# Altium schematic sheet High_Voltage_Converter.SchDoc
size A4
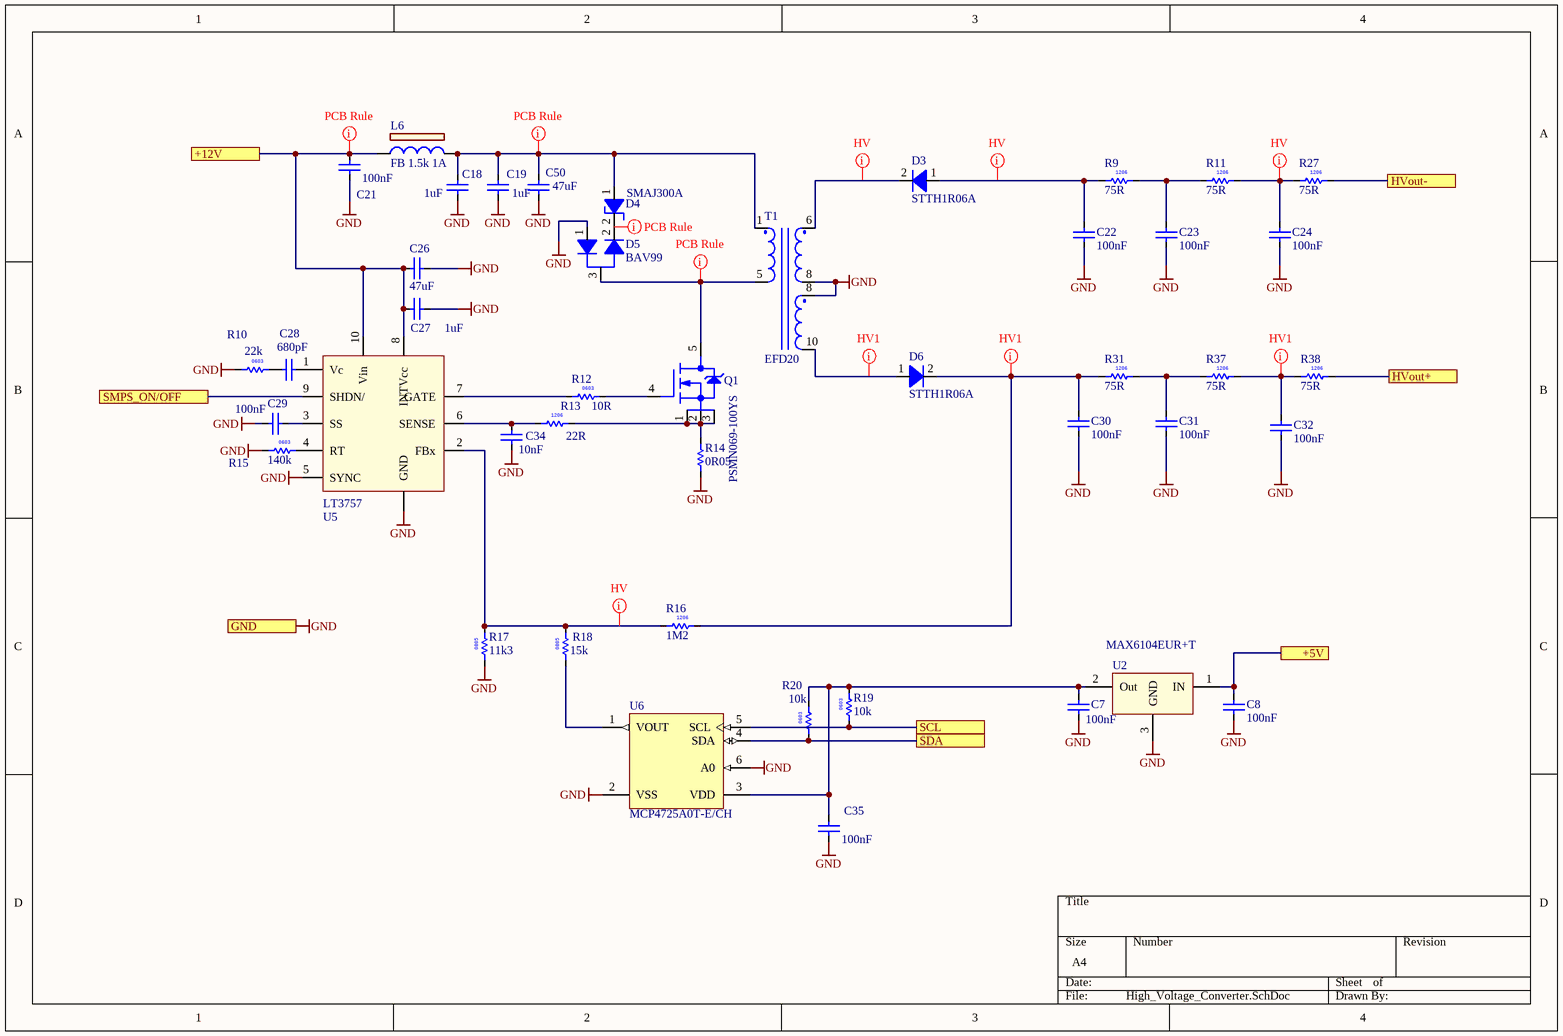
[diagram p0: High_Voltage_Converter.SchDoc]

## Parts
C7  100nF  [C0603V]
C8  100nF  [C0603V]
C18  1uF  [CAPC2012N]
C19  1uF  [CAPC2012N]
C21  100nF  [C0603V]
C22  100nF  [C1808]
C23  100nF  [C1808]
C24  100nF  [C1808]
C26  47uF  [CAPC3225N]
C27  1uF  [CAPC2012N]
C28  680pF  [CAPC3216N]
C29  100nF  [C0603V]
C30  100nF  [C1808]
C31  100nF  [C1808]
C32  100nF  [C1808]
C34  10nF  [CAPC3216N]
C35  100nF  [C0603V]
C50  47uF  [CAPC3225N]
D3  STTH1R06A  [DO-214AC]
D4  SMAJ300A  [DO-214AC]
D5  BAV99  [SOT95P240-3L]
D6  STTH1R06A  [DO-214AC]
L6  FB 1.5k 1A  [LL0805\2P]
Q1  PSMN069-100YS  [SOT669]
R9  75R  [RESC3216N]
R10  22k  [RESC1608X50N]
R11  75R  [RESC3216N]
R12  10R  [RESC1608N]
R13  22R  [RESC3216N]
R14  0R05  [RESC6432AN]
R15  140k  [RESC1608X50N]
R16  1M2  [RESC3216N]
R17  11k3  [RESC2012N]
R18  15k  [RESC2012N]
R19  10k  [RESC1608N]
R20  10k  [RESC1608N]
R27  75R  [RESC3216N]
R31  75R  [RESC3216N]
R37  75R  [RESC3216N]
R38  75R  [RESC3216N]
T1  EFD20  [EFD_20]
U2  MAX6104EUR+T  [SOT23-3]
U5  LT3757  [10-LEAD PLASTIC MSOP - duplicate]
U6  MCP4725A0T-E/CH  [SOT-23-CH6_N]

## Ports
+5V, +12V, GND, HVout+, HVout-, SCL, SDA, SMPS_ON/OFF

## Nets
GND: C7.1 C8.1 C18.2 C19.2 C21.1 C22.1 C23.1 C24.1 C26.2 C27.2 C29.2 C30.1 C31.1 C32.1 C34.1 C35.1 C50.1 D5.1(A1) R10.1 R14.1 R15.1 R17.1 T1.8 U2.3(GND) U5.5(SYNC) U5.GND U6.2(VSS) U6.6(A0) ; port GND
+5V: C8.2 U2.1(IN) ; port +5V
+12V: C21.2 C26.1 C27.1 L6.1 U5.8(INTVcc) U5.10(Vin) ; port +12V
HVout+: R38.2 ; port HVout+
HVout-: R27.2 ; port HVout-
SCL: R19.1 U6.5(SCL) ; port SCL
SDA: R20.1 U6.4(SDA) ; port SDA
SMPS_ON/OFF: U5.9(SHDN/) ; port SMPS_ON/OFF
NetC7_2: C7.2 C35.2 R19.2 R20.2 U2.2(Out) U6.3(VDD)
NetC18_1: C18.1 C19.1 C50.2 D4.1(ANODE) L6.2 T1.1
NetC22_2: C22.2 D3.1(anode) R9.1
NetC23_2: C23.2 R9.2 R11.1
NetC24_2: C24.2 R11.2 R27.1
NetC28_1: C28.1 R10.2
NetC28_2: C28.2 U5.1(Vc)
NetC29_1: C29.1 U5.3(SS)
NetC30_2: C30.2 D6.2(cathode) R16.2 R31.1
NetC31_2: C31.2 R31.2 R37.1
NetC32_2: C32.2 R37.2 R38.1
NetC34_2: C34.2 R13.1 U5.6(SENSE)
NetD3_2: D3.2(cathode) T1.6
NetD4_2: D4.2(CATHODE) D5.2(A)
NetD5_3: D5.3(K) Q1.5(D) T1.5
NetD6_1: D6.1(anode) T1.10
NetQ1_1: Q1.1(S) Q1.2(S) Q1.3(S) R13.2 R14.2
NetQ1_4: Q1.4(G) R12.2
NetR12_1: R12.1 U5.7(GATE)
NetR15_2: R15.2 U5.4(RT)
NetR16_1: R16.1 R17.2 R18.2 U5.2(FBx)
NetR18_1: R18.1 U6.1(VOUT)

## Layout directives
net class HV: NetC22_2, NetC24_2, NetD3_2
net class HV1: NetC30_2, NetC32_2, NetD6_1
rule Clearance Constraint [Clearance = 0.5mm]; rule Width Constraint [Pref Width = 2mm    Min Width = 0.5mm    Max Width = 2mm]: +12V, NetC18_1, NetD4_2, NetD5_3
net class HV; rule Clearance Constraint [Clearance = 0.5mm]: NetR16_1

## Notes on the sheet
- (in symbol R0000001) 0603
- (in symbol R0000008) 0603
- (in symbol R0000022) 1206
- (in symbol R0000478) 0603
- (in symbol R0000571) 0603
- (in symbol R2408097) 0805
- (in symbol R2412032) 1206
- (in symbol R2412045) 1206

## Library data of the parts
C7 C8 C21 C29 C35 = C0000005: MLCC, 0.1uF 16V 10% X7R 0603; Manufacturer: KEMET; Manufacturer Part Number: C0603C104K4RACTU; Voltage: 16; Project: AUT-RX03-00; Note: 0,041 €; Part Number: C0000005; Part Type: MLCC; Tolerance: 10%; Material: X7R; Package: 0603 (1608 metric); SMD: Yes; Supplier 1: Farnell; Supplier Part Number 1: 1414610RL; Supplier 2: Mouser; Supplier Part Number 2: 80-C0603C104K4R; ComponentLink1Description: MFG link; ComponentLink1URL: http://www.kemet.com/datasheets&C0603C104K4RACTU; Data: 2011.02.27
C18 C19 C27 = C0000037: MLCC, 0805, X5R, 16V, 1UF; Manufacturer: MULTICOMP; Manufacturer Part Number: MCCA000596; Voltage: 16; Tolerance: ±10%; Project: Zhilinskas_I/II/III; Part Number: C0000037; Part Type: MLCC; Material: X5R; Package: 0805 (2012 metric); SMD: Yes; Supplier 1: Farnell; Supplier Part Number 1: 1759479; Price: 0,033; MOQ: 1; Supplier 2: Mouser; Supplier Part Number 2: 77-VJ0805V105ZXJCBC; ComponentLink1Description: MFG link; ComponentLink1URL: http://www.farnell.com/datasheets/462001.pdf; Data: 2011.05.05
C22-C24 C30-C32 = C0000111: MLCC, X7R, 100NF, 630V, 1808; Manufacturer: KEMET; Manufacturer Part Number: C1808V104KBRACTU; Voltage: 630; Tolerance: ± 10%; Part Number: C0000111; Part Type: MLCC; Material: X7R; Package: C1808; SMD: Yes; Supplier 1: Farnell; Supplier 2: Mouser; Supplier Part Number 2: 2085209; ComponentLink1Description: MFG link
C26 C50 = C0000077: MLCC, 1210, 47uF, 16V; Manufacturer: MURATA; Manufacturer Part Number: GRM32ER61C476ME15L; Voltage: 16; Tolerance: ±20%; Material: X5R; Part Number: C0000077; Part Type: MLCC; Package: 1210 (3225 metric); SMD: Yes; Supplier 1: Farnell; Supplier Part Number 1: 1735538; ComponentLink1Description: MFG link; ComponentLink1URL: http://www.farnell.com/datasheets/415303.pdf; Qty: 0; Data: 2012-01-20
C28 = C0000056: MLCC, 680PF, 630V, C0G/NP0, 1206; Manufacturer: MULTICOMP; Manufacturer Part Number: MC1206N681J631CT; Voltage: 630; Tolerance: ±5%; Part Number: C0000056; Part Type: MLCC; Material: C0G / NP0; Package: 1206 (3216 metric); SMD: Yes; Supplier 1: Farnell; Supplier Part Number 1: 1875399; ComponentLink1Description: MFG link; Qty: 5; Data: 2011.07.27
C34 = C0000012: MLCC, 10nF, 630V, ±10% ,X7R, 1206; Manufacturer: TDK; Manufacturer Part Number: C3216X7R2J103M; Voltage: 630; Project: AUT-RX03-00; Note: 0,182 €; Part Number: C0000012; Part Type: MLCC; Tolerance: ±10%; Material: X7R; Package: 1206 (3216 metric); SMD: Yes; Supplier 2: Mouser; Supplier Part Number 2: 810-C3216X7R2J103M; ComponentLink1Description: MFG link; ComponentLink1URL: http://www.tdk.co.jp/tefe02/e413_c.pdf; Data: 2011.02.28
D3 D6 = D0000024: DIODE, fast, 1A, 600V, SMD, SMA; Manufacturer: ST Microelectronics; Vforvard: 1V; Capacitance: 12pF; Part Number: D0000024; Part Type: Diode\Rectifier; Reverse Voltage: 600V; Current: 1A; SMD: Yes; Manufacturer Part Number: STTH1R06A; ComponentLink1Description: MFG link; ComponentLink1URL: http://www.st.com/internet/com/TECHNICAL_RESOURCES/TECHNICAL_LITERATURE/DATASHEET/CD00005135.pdf; ComponentLink2Description: DataSheet; Qty: 5; Data: 2011.06.30; Supplier 1: Farnell; Supplier Part Number 1: 1697520
D4 = D0000021: TVS DIODE, 400W, 300V, DO-214AC; Manufacturer: LITTELFUSE; Part Number: D0000021; Part Type: Diode\TVS\Unidir; Vforvard: 300V; Rating: 400W; SMD: Yes; Manufacturer Part Number: SMAJ300A; ComponentLink1Description: MFG link; ComponentLink1URL: http://www.littelfuse.com/data/en/Data_Sheets/Littelfuse_TVS-Diode_SMAJ.pdf; ComponentLink2Description: DataSheet; Qty: 5; Data: 2011.07.15; Supplier 1: Farnell; Supplier Part Number 1: 1677461; Supplier 2: Mouser; Supplier Part Number 2: 576-SMAJ300A
D5 = D0000001: DIODE SW DUAL 75V 350mW SOT23; Manufacturer Part Number: BAV99-7-F; Vforvard: 1.25V; Current: 2A; Project: AUT-RX03-00; Note: 0,289 €; Part Number: D0000001; Part Type: Diode\Small signal; Reverse Voltage: 75V; Rating: 350mW; SMD: Yes; ComponentLink1Description: MFG link; ComponentLink1URL: http://www.onsemi.com/pub_link/Collateral/BAV99LT1-D.PDF; ComponentLink2Description: DataSheet; Qty: 6000; Data: 2011.02.27; Supplier 1: Farnell; Supplier Part Number 1: 1843683; Supplier 2: Mouser; Supplier Part Number 2: 621-BAV99-F
L6 = L0000004: BEAD FERRITE, SMD 1500OHM, 0805; Manufacturer: Wurth Elektronik; Manufacturer Part Number: 742792097; Resistance: 1500; Project: PSP500; Part Number: L0000004; Part Type: Ferrite\Bead; SMD: Yes; Supplier 1: Farnell; Supplier Part Number 1: 1635738; Supplier 2: Mouser; Supplier Part Number 2: 710-742792097; ComponentLink1Description: MFG link; ComponentLink1URL: http://katalog.we-online.de/kataloge/eisos/media/pdf/742792097.pdf; ComponentLink2Description: DataSheet; Data: 2011.02.01
Q1 = Q0000050: MOSFET 100V, 72.4 mOhm standard level, LFPAK; Manufacturer: NXP; RdsON: 130mΩ; Id: 17A; InputCapacitance: 645pF; Part Number: Q0000050; Part Type: MOSFET\N-CH; Vds: 100V; SMD: Yes; Manufacturer Part Number: PSMN069-100YS; Supplier 1: Farnell; Supplier Part Number 1: 1845662RL; ComponentLink1Description: MFG link; ComponentLink1URL: http://www.nxp.com/documents/data_sheet/PSMN069-100YS.pdf; ComponentLink2Description: Datasheet MFG; Qty: 10; Data: 2012.03.26
R9 R11 R27 R31 R37 R38 = R2412045: 75R 5% 1206 1/4W; R2408042: R2412045; Part type: Carbon Film; Tolerance: ±5%; Power: 1/4W; Package: 1206 (3216 metric); SMD: Yes; Data: 2011-01-31
R10 = R0000478: Res, 22K, 0603 (1608 metric), ±1%, 100mW, 75V; Manufacturer: PANASONIC; Manufacturer Part Number: ERJ3EKF2202V; R2408042: R0000478; Part type: Thick Film; Tolerance: ±1%; Power: 100mW; Package: 0603 (1608 metric); SMD: Yes; Supplier 1: Farnell; ComponentLink1Description: MFG link; ComponentLink1URL: http://www.farnell.com/datasheets/1678782.pdf; Data: 2015.09.15
R12 = R0000001: Res, 0603 0.1W 5%; Manufacturer: PANASONIC; Manufacturer Part Number: ERJ-3GEYJ100V; R2408042: R0000001; Part type: Thick Film; Tolerance: ±5%; Power: 0.1W; Package: 0603 (1608 metric); SMD: Yes; Supplier 1: Farnell; Supplier Part Number 1: 2059548; Supplier 2: Mouser; Supplier Part Number 2: 667-ERJ-3GEYJ100V; ComponentLink1Description: Datasheet MFG; ComponentLink1URL: http://www.panasonic.com/industrial/components/pdf/AOA0000CE1.pdf; Data: 2011.02.27
R13 = R2412032: 22R 5% 1206 1/4W; R2408042: R2412032; Part type: Carbon Film; Tolerance: ±5%; Power: 1/4W; Package: 1206 (3216 metric); SMD: Yes; Data: 2011.01.31
R14 = R2412183: Res, 0.05R 1% 2512 1W; Manufacturer: WELWYN; Manufacturer Part Number: LR2512-R05FW; Note: S; R2408042: R2412183; Part type: Thick Film; Tolerance: ±1%; Power: 1W; Package: 2512 (6431 metric); SMD: Yes; Supplier 1: Farnell; Supplier Part Number 1: 1100065; ComponentLink1Description: MFG link; Qty: 5; Data: 2011.09.22
R15 = R0000571: Res, 140K, 0603 (1608 metric), ±1%, 100mW, 75V; Manufacturer: PANASONIC; Manufacturer Part Number: ERJ3EKF1403V; R2408042: R0000571; Part type: Thick Film; Tolerance: ±1%; Power: 100mW; Package: 0603 (1608 metric); SMD: Yes; Supplier 1: Farnell; ComponentLink1Description: MFG link; ComponentLink1URL: http://www.farnell.com/datasheets/1678782.pdf; Data: 2015.09.15
R16 = R0000022: Res, 1M 0.25W, 1% 1206; Manufacturer: Bourns; Manufacturer Part Number: CR1206-FX-1004ELF; Project: AUT-RX03-00; Note: 0,041 €; R2408042: R0000022; Part type: Thick Film; Tolerance: ±1%; Power: 0.25W; Package: 1206 (3216 metric); SMD: Yes; Supplier 2: Mouser; Supplier Part Number 2: 652-CR1206FX-1004ELF; ComponentLink1Description: Datasheet MFG; ComponentLink1URL: http://www.bourns.com/data/global/pdfs/CHPREZTR.pdf; Data: 2011.03.05
R17 R18 = R2408097: Res, 11K 5% 0805 1/8W; R2408042: R2408097; Part type: Carbon Film; Tolerance: ±5%; Power: 1/8W; Package: 0805 (2012 metric); SMD: Yes; Data: 2011.01.31
R19 R20 = R0000008: Res, 10K 0.063W 75V 1%  0603; Manufacturer: MULTICOMP; Manufacturer Part Number: MCMR06X1002FTL; Project: AUT-RX03-00; Note: 0,033 €; R2408042: R0000008; Part type: Thick Film; Tolerance: ±1%; Power: 0.063W; Package: 0603 (1608 metric); SMD: Yes; Supplier 1: Farnell; Supplier Part Number 1: 2073349; Supplier 2: Mouser; Supplier Part Number 2: 594-MCT06030C1002FP5; ComponentLink1Description: Datasheet MFG; ComponentLink1URL: http://www.vishay.com/doc?28705; Data: 2011.02.28
T1 = EFD_20: Supplier 1: Newark; Supplier Part Number 1: 06W0667
U2 = MAX6104EUR+T: Low-Cost, Micropower, Low-Dropout,  High-Output-Current, SOT23 Voltage References; Supplier 1: Farnell; Supplier Part Number 1: 2511340
U5 = LT3757: Boost, Flyback, SEPIC and  Inverting Controller; Supplier 1: Farnell; Supplier Part Number 1: 2294952
U6 = MCP4725A0T-E/CH: 12-Bit Digital-to-Analog Converter with EEPROM Memory in SOT-23-6, 6-Pin SOT-23, Extended Temperature, Tape and Reel; Published: 29-Jan-2009; LatestRevisionDate: 02-Dec-2009; LatestRevisionNote: Updated to datasheet revision D, Jun-2009; DatasheetVersion: revD, Jun-2009; PackageVersion: revBB, Aug-2009; PackageReference: SOT-23-CH6; Publisher: Altium Limited; PackageDescription: 6-Lead Plastic Small Outline Transistor (CH) [SOT-23]; Supplier 1: Digi-Key; Supplier Part Number 1: MCP4725A0T-E/CHTR-ND; Supplier 2: Digi-Key; Supplier Part Number 2: MCP4725A0T-E/CHCT-ND; Supplier 3: Digi-Key; Supplier Part Number 3: MCP4725A0T-E/CHDKR-ND; Supplier 4: Farnell; Supplier Part Number 4: 1578449; Code_IPC: SOT26A-6; ComponentLink1Description: Datasheet; ComponentLink1URL: http://ww1.microchip.com/downloads/en/DeviceDoc/22039d.pdf; ComponentLink2Description: Packaging Specification; ComponentLink2URL: http://www.microchip.com/stellent/groups/techpub_sg/documents/packagingspec/en012702.pdf; ComponentLink3Description: Microchip.com Home; ComponentLink3URL: http://www.microchip.com/